# Altium project MMA8652FCR1.PrjPcb
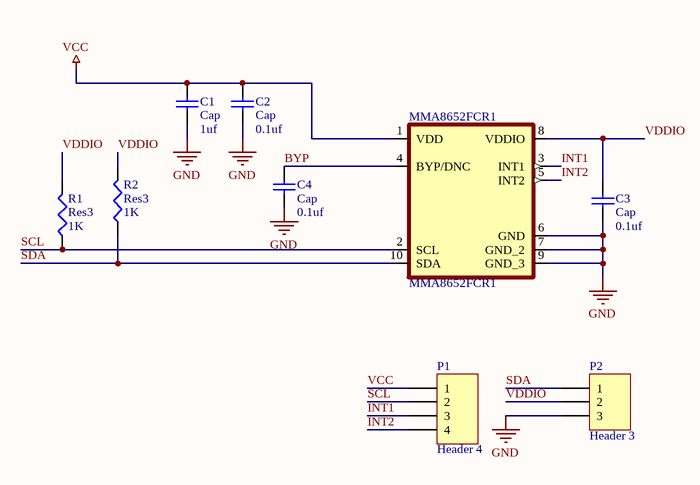
[diagram p0: MMA8652FCR1.SchDoc]
1 sheet, 9 parts. Net scope: global (net labels, ports and power ports of the same name join across sheets).
Board file: MMA8652FCR1.PcbDoc

## Sheet MMA8652FCR1.SchDoc: Evaluation Board MMA8652FCR1
size A4; Date: 07/12/2016; CheckedBy: Nicolas LAW; Author: Nicolas LAW; DrawnBy: Nicolas LAW; Engineer: Nicolas LAW; Revision: 1; SheetNumber: 1; SheetTotal: 1; DocumentName: Evaluation Board MMA8652FCR1; ProjectName: Knocklet

### Parts
C1  Cap  value 1uf  [capacitor_10uf]
C2  Cap  value 0.1uf  [capacitor_10uf]
C3  Cap  value 0.1uf  [Capacitor_100nf]
C4  Cap  value 0.1uf  [capacitor_10uf]
MMA8652FCR1  MMA8652FCR1  [MMA8652FCR1]
P1  Header 4  [HDR1X4]
P2  Header 3  [HDR1X3]
R1  Res3  value 1K  [J1-0603]
R2  Res3  value 1K  [J1-0603]

### Nets
GND: C1.1 C2.1 C3.1 C4.1 MMA8652FCR1.6(GND) MMA8652FCR1.7(GND_2) MMA8652FCR1.9(GND_3) P2.3
VCC: C1.2 C2.2 MMA8652FCR1.1(VDD) P1.1
BYP: C4.2 MMA8652FCR1.4(BYP/DNC)
INT1: MMA8652FCR1.3(INT1) P1.3
INT2: MMA8652FCR1.5(INT2) P1.4
SCL: MMA8652FCR1.2(SCL) P1.2 R1.1
SDA: MMA8652FCR1.10(SDA) P2.1 R2.1
VDDIO: C3.2 MMA8652FCR1.8(VDDIO) P2.2 R1.2 R2.2

### Notes on the sheet
- Title
- Size:
- Date:
- A4
- Number:
- Time:
- Revision:
- Sheet
- of
- File:

### Library data of the parts
C1-C4 = Cap: Capacitor; Published: 8-Jun-2000; LatestRevisionDate: 17-Jul-2002; LatestRevisionNote: Re-released for DXP Platform.; PackageReference: RAD-0.3; Publisher: Altium Limited; PackageDescription: Radial Cap, Thru-Hole; 2 Leads; 0.3 in Pin Spacing
P1 = Header 4: Header, 4-Pin; LatestRevisionDate: 17-Jul-2002; LatestRevisionNote: Re-released for DXP Platform.; Publisher: Altium Limited
P2 = Header 3: Header, 3-Pin; LatestRevisionDate: 17-Jul-2002; LatestRevisionNote: Re-released for DXP Platform.; Publisher: Altium Limited
R1 R2 = Res3: Resistor; Published: 8-Jun-2000; LatestRevisionDate: 29-May-2009; LatestRevisionNote: IPC-7351 Footprint Added.; PackageReference: J1-0603; Publisher: Altium Limited; PackageDescription: Chip Resistor